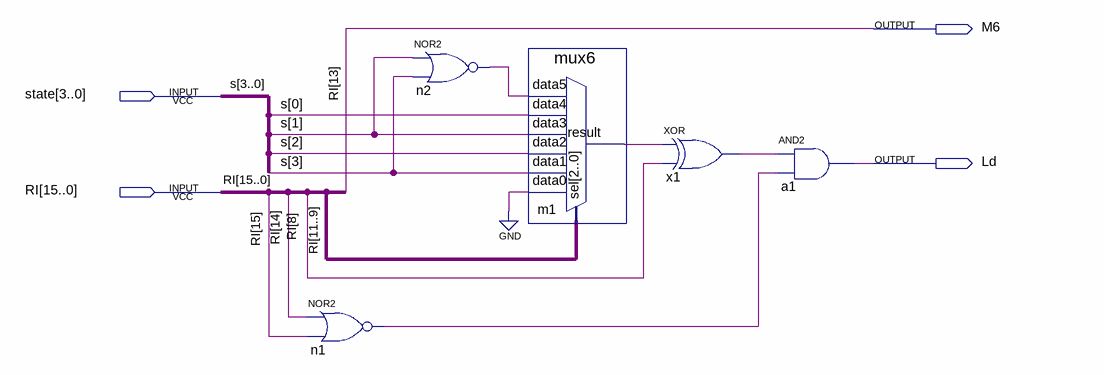
[diagram p0: schematic sheet]
// Quartus schematic branch_unit.bdf as structural Verilog: 5 symbols, 4 pins
module branch_unit (
  input  [3:0] state,
  input  [15:0] RI,
  output M6,
  output Ld
);

  wire m1_result, n1_out, n2_out, x1_out;

  nor n1 (n1_out, RI[14], RI[15]);
  nor n2 (n2_out, state[1], state[3]);
  mux6 m1 (
    .data5(n2_out), .data4(state[0]), .data3(state[1]), .data2(state[2]), .data1(state[3]), .data0(1'b0),
    .sel(RI[11:9]), .result(m1_result));
  xor x1 (x1_out, m1_result, RI[8]);
  and a1 (Ld, x1_out, n1_out);

  assign M6 = RI[13];

  // Other names for the same wires on the sheet: s[3:0] = state
endmodule
